# EAGLE design brains (EAGLE 7.3.0)
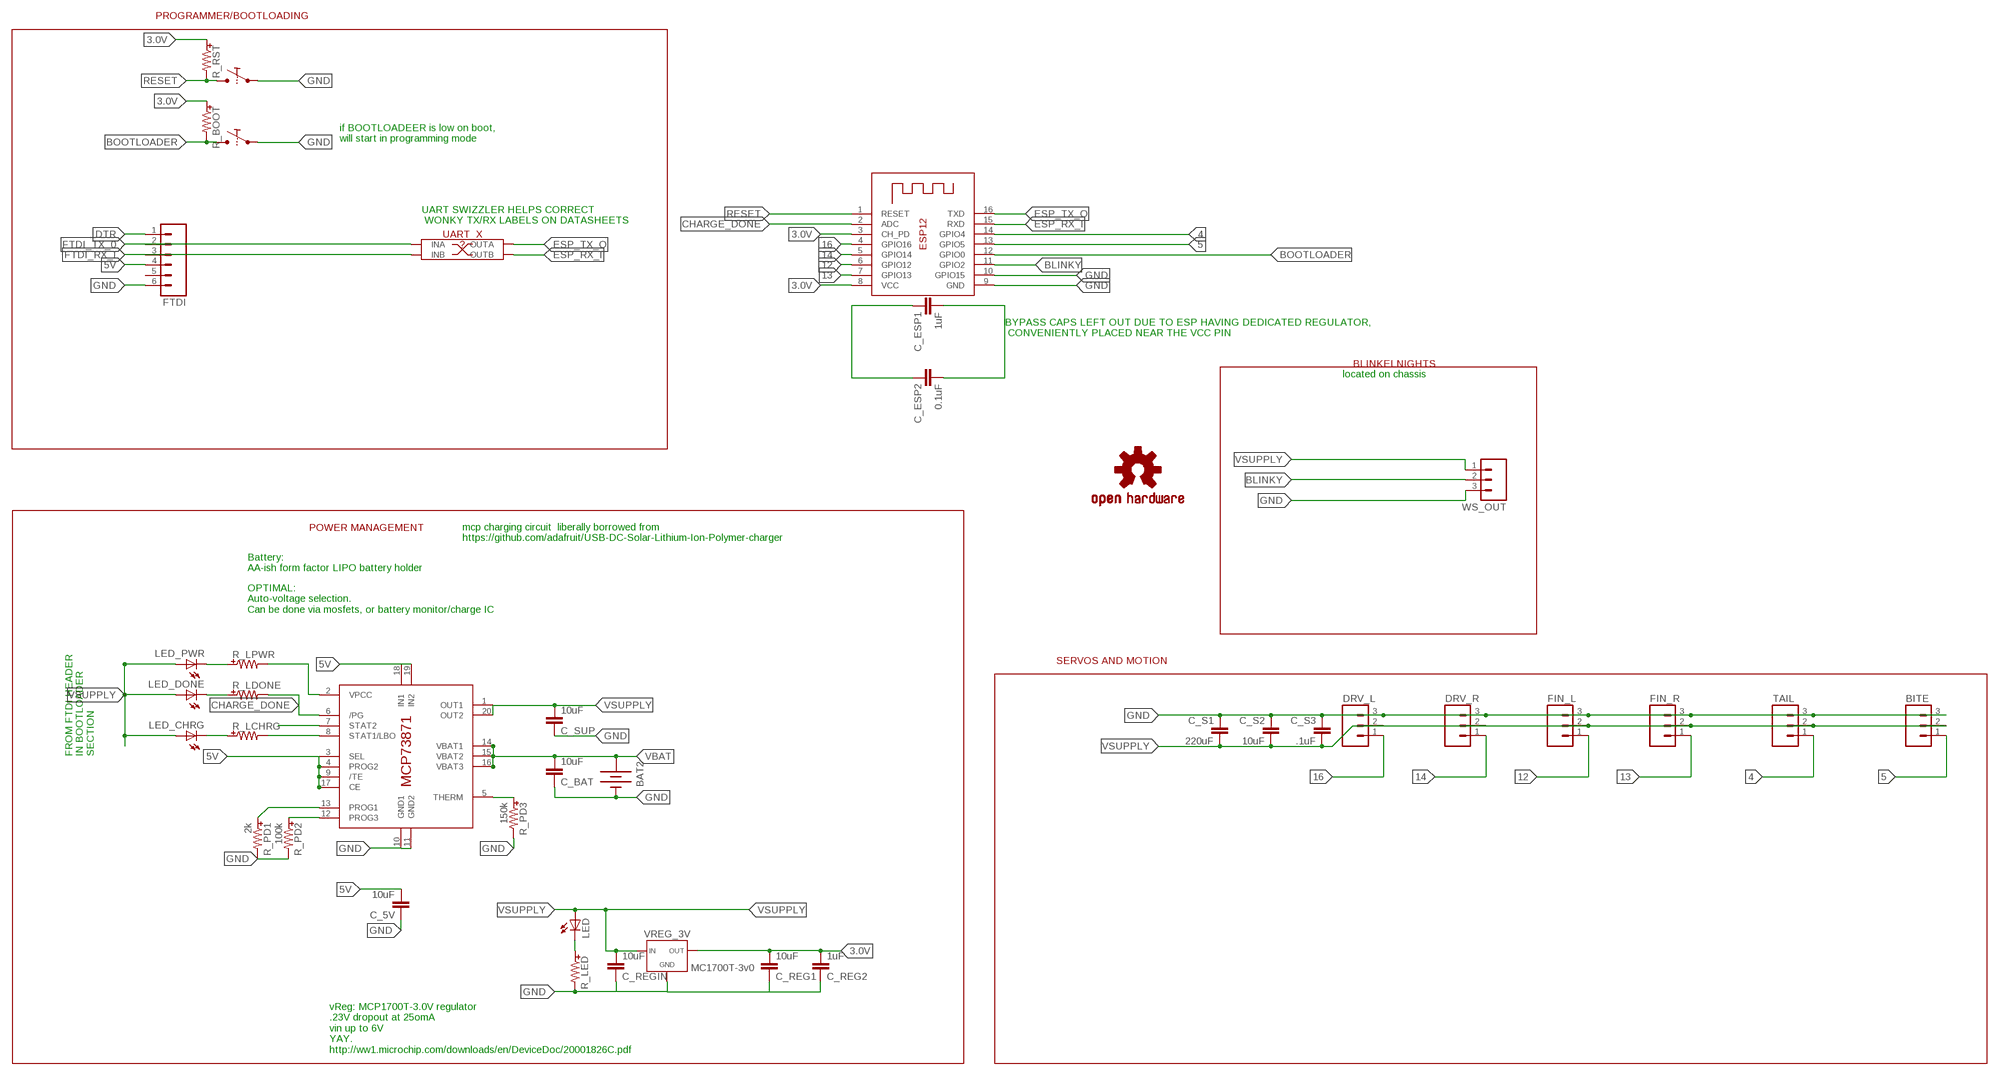
[diagram p0: schematic, sheet 1]

## Parts
BAT2  BATTERYAA  [BATTERY-AA]
BITE  M03LOCK  [1X03_LOCK]
BTN_PROG  BUTTONPJRC  [BUTTON-PJRC]
BTN_RST  BUTTONPJRC  [BUTTON-PJRC]
C_5V  10uF  CAPUNIVERSAL  [0402-0603-0805-UNIVERSAL]
C_BAT  10uF  CAPUNIVERSAL  [0402-0603-0805-UNIVERSAL]
C_ESP1  1uF  CAPUNIVERSAL  [0402-0603-0805-UNIVERSAL]
C_ESP2  0.1uF  CAPUNIVERSAL  [0402-0603-0805-UNIVERSAL]
C_REG1  10uF  CAPUNIVERSAL  [0402-0603-0805-UNIVERSAL]
C_REG2  1uF  CAPUNIVERSAL  [0402-0603-0805-UNIVERSAL]
C_REGIN  10uF  CAPUNIVERSAL  [0402-0603-0805-UNIVERSAL]
C_S1  220uF  CAP1210  [1210]
C_S2  10uF  CAPUNIVERSAL  [0402-0603-0805-UNIVERSAL]
C_S3  .1uF  CAPUNIVERSAL  [0402-0603-0805-UNIVERSAL]
C_SUP  10uF  CAPUNIVERSAL  [0402-0603-0805-UNIVERSAL]
DRV_L  M03LOCK  [1X03_LOCK]
DRV_R  M03LOCK  [1X03_LOCK]
FIN_L  M03LOCK  [1X03_LOCK]
FIN_R  M03LOCK  [1X03_LOCK]
FTDI  M06LOCK  [1X06_LOCK]
IC_LIPO  MCP73871  [QFN20]
LED  LEDUNIVERSAL  [0402-0603-0805-UNIVERSAL]
LED_CHRG  LEDUNIVERSAL  [0402-0603-0805-UNIVERSAL]
LED_DONE  LEDUNIVERSAL  [0402-0603-0805-UNIVERSAL]
LED_PWR  LEDUNIVERSAL  [0402-0603-0805-UNIVERSAL]
LOGO1  OSHW-LOGOS  [OSHW-LOGO-S]
R_BOOT  RESISTORUNIVERSAL  [0402-0603-0805-UNIVERSAL]
R_LCHRG  RESISTORUNIVERSAL  [0402-0603-0805-UNIVERSAL]
R_LDONE  RESISTORUNIVERSAL  [0402-0603-0805-UNIVERSAL]
R_LED  RESISTORUNIVERSAL  [0402-0603-0805-UNIVERSAL]
R_LPWR  RESISTORUNIVERSAL  [0402-0603-0805-UNIVERSAL]
R_PD1  2k  RESISTORUNIVERSAL  [0402-0603-0805-UNIVERSAL]
R_PD2  100k  RESISTORUNIVERSAL  [0402-0603-0805-UNIVERSAL]
R_PD3  150k  RESISTORUNIVERSAL  [0402-0603-0805-UNIVERSAL]
R_RST  RESISTORUNIVERSAL  [0402-0603-0805-UNIVERSAL]
TAIL  M03LOCK  [1X03_LOCK]
UART_X  UART_SWITCHER0603  [UART_SWITCHER_0603]
VREG_3V  MC1700T-3v0  VOLTAGE-REGULATORMCP1703  [SOT23]
WS_OUT  M03LOCK  [1X03_LOCK]
X1  ESP-12  [ESP-12]

## Nets
3.0V: C_REG1.+ C_REG2.+ R_BOOT.+ R_RST.+ VREG_3V.2(OUT) X1.3(CH_PD) X1.8(VCC)
4: TAIL.1 X1.14(GPIO4)
5: BITE.1 X1.13(GPIO5)
5V: C_5V.+ FTDI.4 IC_LIPO.3(SEL) IC_LIPO.4(PROG2) IC_LIPO.9(/TE) IC_LIPO.17(CE) IC_LIPO.18(IN1) IC_LIPO.19(IN2)
12: FIN_L.1 X1.6(GPIO12)
13: FIN_R.1 X1.7(GPIO13)
14: DRV_R.1 X1.5(GPIO14)
16: DRV_L.1 X1.4(GPIO16)
BLINKY: WS_OUT.2 X1.11(GPIO2)
BOOTLOADER: BTN_PROG.A1 BTN_PROG.A2 R_BOOT.- X1.12(GPIO0)
CHARGE_DONE: IC_LIPO.6(/PG) R_LDONE.- X1.2(ADC)
DTR: FTDI.1
ESP_RX_I: UART_X.TX_B(OUTB) X1.15(RXD)
ESP_TX_O: UART_X.RX_B(OUTA) X1.16(TXD)
FTDI_RX_I: FTDI.3 UART_X.RX_A(INB)
FTDI_TX_0: FTDI.2 UART_X.TX_A(INA)
GND: BAT2.GND@1(-) BITE.3 BTN_PROG.B1 BTN_PROG.B2 BTN_RST.B1 BTN_RST.B2 C_5V.- C_BAT.- C_REG1.- C_REG2.- C_REGIN.- C_S1.1 C_S2.- C_S3.- C_SUP.- DRV_L.3 DRV_R.3 FIN_L.3 FIN_R.3 FTDI.6 IC_LIPO.10(GND1) IC_LIPO.11(GND2) R_LED.- R_PD1.- R_PD2.- R_PD3.- TAIL.3 VREG_3V.1(GND) WS_OUT.3 X1.9(GND) X1.10(GPIO15)
N$1: IC_LIPO.8(STAT1/LBO) R_LCHRG.-
N$3: C_ESP1.- C_ESP2.-
N$4: IC_LIPO.5(THERM) R_PD3.+
N$5: LED_CHRG.-(C) R_LCHRG.+
N$6: LED.-(C) R_LED.+
N$7: LED_DONE.-(C) R_LDONE.+
N$8: LED_PWR.-(C) R_LPWR.+
N$9: IC_LIPO.2(VPCC) R_LPWR.-
N$10: C_ESP1.+ C_ESP2.+
N$20: IC_LIPO.7(STAT2)
N$22: IC_LIPO.12(PROG3) R_PD2.+
N$23: IC_LIPO.13(PROG1) R_PD1.+
RESET: BTN_RST.A1 BTN_RST.A2 R_RST.- X1.1(RESET)
VBAT: BAT2.PWR@1(+) C_BAT.+ IC_LIPO.14(VBAT1) IC_LIPO.15(VBAT2) IC_LIPO.16(VBAT3)
VSUPPLY: BITE.2 C_REGIN.+ C_S1.2 C_S2.+ C_S3.+ C_SUP.+ DRV_L.2 DRV_R.2 FIN_L.2 FIN_R.2 IC_LIPO.1(OUT1) IC_LIPO.20(OUT2) LED.+(A) LED_CHRG.+(A) LED_DONE.+(A) LED_PWR.+(A) TAIL.2 VREG_3V.3(IN) WS_OUT.1
Unconnected: FTDI.5

## Notes on the sheet
- PROGRAMMER/BOOTLOADING
- if BOOTLOADEER is low on boot, 
  will start in programming mode
- UART SWIZZLER HELPS CORRECT
   WONKY TX/RX LABELS ON DATASHEETS
- BYPASS CAPS LEFT OUT DUE TO ESP HAVING DEDICATED REGULATOR,
   CONVENIENTLY PLACED NEAR THE VCC PIN
- BLINKELNIGHTS
- located on chassis
- POWER MANAGEMENT
- mcp charging circuit  liberally borrowed from 
  https://github.com/adafruit/USB-DC-Solar-Lithium-Ion-Polymer-charger
- Battery: 
  AA-ish form factor LIPO battery holder
- OPTIMAL: 
  Auto-voltage selection. 
  Can be done via mosfets, or battery monitor/charge IC
- SERVOS AND MOTION
- FROM FTDI HEADER
  IN BOOTLOADER 
  SECTION
- vReg: MCP1700T-3.0V regulator
  .23V dropout at 25omA
  vin up to 6V 
  YAY.
  http://ww1.microchip.com/downloads/en/DeviceDoc/20001826C.pdf

## Library data of the parts
BAT2 = SparkFun-Electromechanical:BATTERY: Battery Holders Various common sizes : AA, AAA, 18650 (PRT-12895), 20mm coin cell and 12mm coin cell. 20MM_4LEGS, BATT-10373
BITE DRV_L DRV_R FIN_L FIN_R TAIL WS_OUT = SparkFun-Connectors:M03: Header 3 Standard 3-pin 0.1" header. Use with straight break away headers (SKU : PRT-00116), right angle break away headers (PRT-00553), swiss pins (PRT-00743), machine pins (PRT-00117), and female headers (PRT-00115). Molex polarized connector foot print use with SKU : PRT-08232 with associated crimp pins and housings.
BTN_PROG BTN_RST = tekdemo:BUTTON
C_5V C_BAT C_ESP1 C_ESP2 C_REG1 C_REG2 C_REGIN C_S1-C_S3 C_SUP = tekdemo:CAP: Capacitor Standard 0603 ceramic capacitor, and 0.1" leaded capacitor.
FTDI = SparkFun-Connectors:M06: Header 6 Standard 6-pin 0.1" header. Use with straight break away headers (SKU : PRT-00116), right angle break away headers (PRT-00553), swiss pins (PRT-00743), machine pins (PRT-00117), and female headers (PRT-00115). Molex polarized connector foot print use with SKU : PRT-08094 with associated crimp pins and housings. NOTES ON THE VARIANTS LOCK and LOCK_LONGPADS... This footprint was designed to help hold the alignment of a through-hole component (i.e. 6-pin header) while soldering it into place. You may notice that each hole has been shifted either up or down by 0.005 of an inch from it's more standard position (which is a perfectly straight line). This slight alteration caused the pins (the squares in the middle) to touch the edges of the holes. Because they are alternating, it causes a "brace" to hold the component in place. 0.005 has proven to be the perfect amount of "off-center" position when using our standard breakaway headers. Although looks a little odd when you look at the bare footprint, once you have a header in there, the alteration is very hard to notice. Also,if you push a header all the way into place, it is covered up entirely on the bottom side. This idea of altering the position of holes to aid alignment will be further integrated into the Sparkfun Library for other footprints. It can help hold any component with 3 or more connection pins.
IC_LIPO = adafruit:MCP73871
LED LED_CHRG LED_DONE LED_PWR = tekdemo:LED: LEDs Standard schematic elements and footprints for 5mm, 3mm, 1206, and 0603 sized LEDs. 5mm - Spark Fun Electronics SKU : Comp-SBL
LOGO1 = tekdemo:OSHW-LOGO: Open Source Hardware Logo This logo indicates the piece of hardware it is found on incorporates a OSHW license and/or adheres to the definition of open source hardware found here: http://freedomdefined.org/OSHW
R_BOOT R_LCHRG R_LDONE R_LED R_LPWR R_PD1-R_PD3 R_RST = tekdemo:RESISTOR: Resistor Basic schematic elements and footprints for 0603, 1206, and PTH resistors.
UART_X = tekdemo:UART_SWITCHER
VREG_3V = tekdemo:VOLTAGE-REGULATOR
X1 = adafruit:ESP-12

## Board
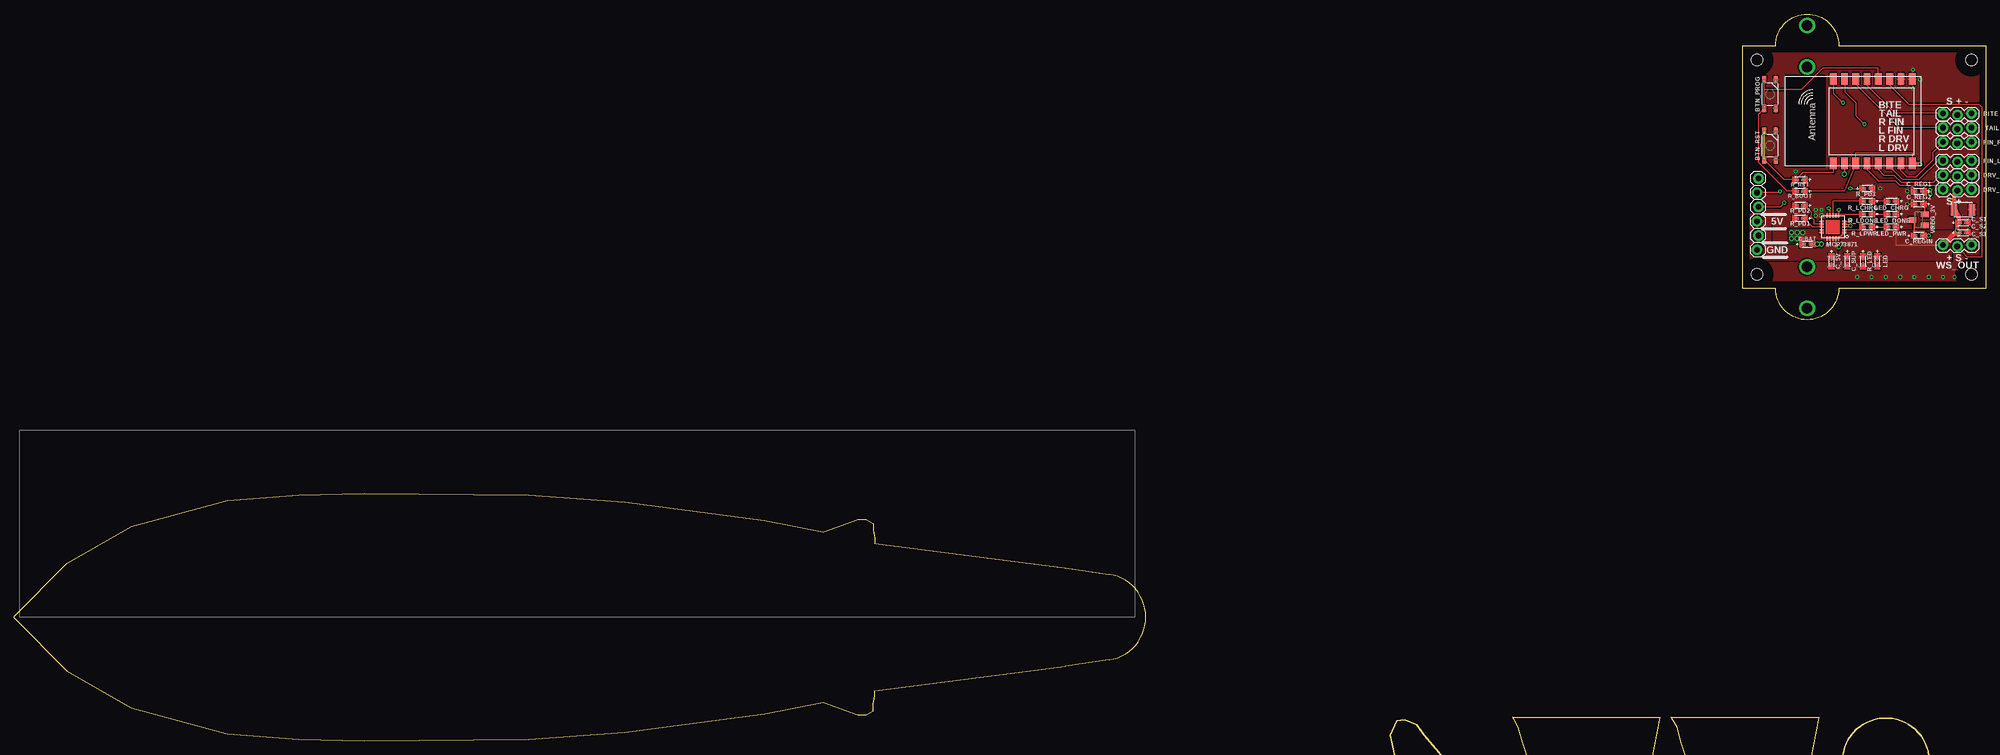
[diagram p1: board, top side]
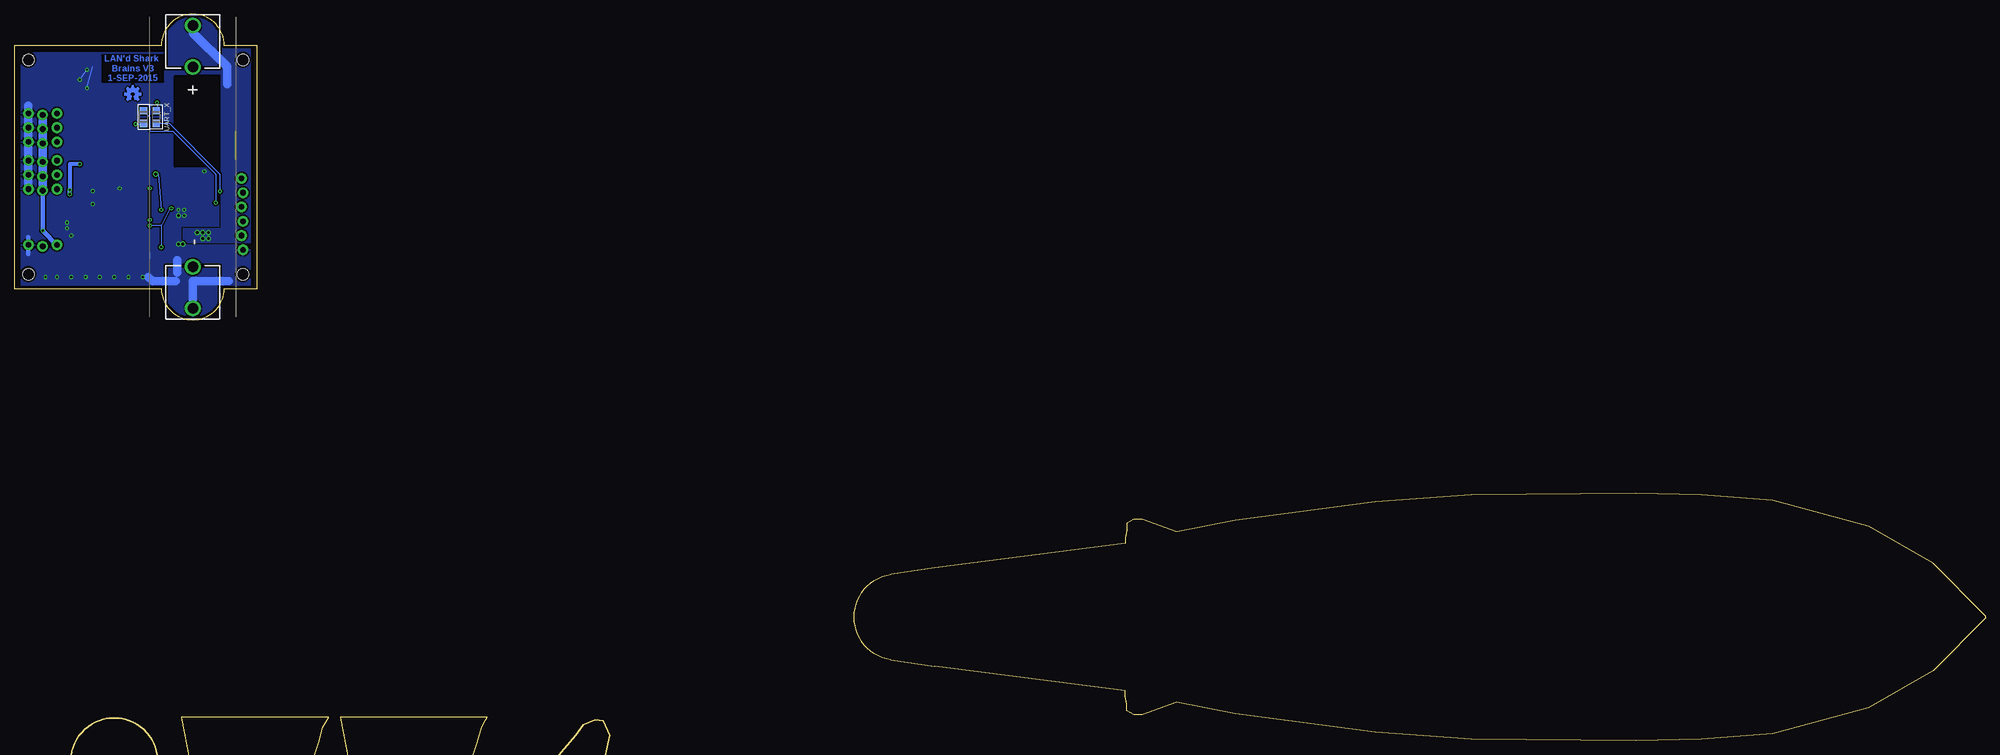
[diagram p2: board, bottom side, seen from below]

Size 350.27 x 129.16 mm. Coordinates in mm from the lower left corner, seen from the top.
Outline: 0,22.1 9.4,31.5 20.83,38.1 37.85,42.67 50.55,43.69 62.23,43.94 91.44,43.69 108.46,42.42 133.35,39.12 143.76,37.08 149.86,39.37 151.38,39.37 152.65,38.61 152.65,37.34 152.91,36.07 152.91,35.05 186.69,30.73 194.56,29.59 arc-161 194.56,14.35 186.69,13.21 152.91,8.89 152.91,7.87 152.65,6.6 152.65,5.33 151.38,4.57 149.86,4.57 143.76,6.86 133.35,4.83 108.46,1.52 91.44,0.25 62.23,0 50.55,0.25 37.85,1.27 20.83,5.84 9.4,12.45 0,21.84 0,22.1
Outline: 307.09,80.39 307.09,123.57 312.93,123.57 arc-90 318.52,129.16 arc-90 324.1,123.57 350.27,123.57 350.27,80.39 324.1,80.39 arc-90 318.52,74.8 arc-90 312.93,80.39 307.09,80.39
Copper layers (1*16): Top 0.0356mm / dielectric 1.5011mm / Bottom 0.0356mm
Design rules "LaenPCBOrder-tented": minimum track width 6mil, minimum drill 13mil, track to track 6mil, track to pad 6mil, pad to pad 6mil, via to via 6mil, smd to smd 0mil, copper to edge 15mil, drill to drill 6mil, minimum pad ring 7mil, minimum via ring 7mil, stop-mask expansion 4mil, vias tented up to drill 25mil, thermal gap 10mil
Holes 2.1 mm at 309.63,82.93 347.73,82.93 309.63,121.03 347.73,121.03
tRestrict: area 345.2,80.4 to 350.3,85.5; area 307.1,80.4 to 312.2,85.5; area 307.1,118.5 to 312.2,123.6; area 345.2,118.5 to 350.3,123.6
Milling: 178 lines

### Footprints (pad centres in the part's own frame; a part is rotated, then mirrored left to right if it is on the bottom)
BATTERY-AA = drill 1.854: GND@1 25.146,0; GND@2 17.78,0; PWR@1 -25.146,0; PWR@2 -17.78,0
1X03_LOCK = drill 1.016 pad 1.88: 1 0,0.127; 2 2.54,-0.127; 3 5.08,0.127
BUTTON-PJRC = smd 1.27 x 0.762: A1 -2.54,-1.016; A2 2.54,-1.016; B1 -2.54,1.016; B2 2.54,1.016
0402-0603-0805-UNIVERSAL = smd 0.254 x 0.254: + -0.762,0; - 0.762,0
1210 = smd 1.2 x 2: 1 -1.6,0; 2 1.6,0
1X06_LOCK = drill 1.016 pad 1.88: 1 0,0; 2 2.54,-0.254; 3 5.08,0; 4 7.62,-0.254; 5 10.16,0; 6 12.7,-0.254
QFN20 = smd 0.75 x 0.3: 1 -2,1; 2 -2,0.5; 3 -2,0; 4 -2,-0.5; 5 -2,-1; 11 2,-1; 12 2,-0.5; 13 2,0; 14 2,0.5; 15 2,1 | smd 0.3 x 0.75: 6 -1,-2; 7 -0.5,-2; 8 0,-2; 9 0.5,-2; 10 1,-2; 16 1,2; 17 0.5,2; 18 0,2; 19 -0.5,2; 20 -1,2
UART_SWITCHER_0603 = smd 1.27 x 1.27: RX_A -1.143,-1.143; RX_B -1.143,1.143; TX_A 1.143,1.143; TX_B 1.143,-1.143
SOT23 = smd 1 x 1.4: 1 -0.95,-1.1; 2 0.95,-1.1; 3 0,1.1
ESP-12 = smd 2 x 1.2: 1 -7.5,4.5; 2 -7.5,2.5; 3 -7.5,0.5; 4 -7.5,-1.5; 5 -7.5,-3.5; 6 -7.5,-5.5; 7 -7.5,-7.5; 8 -7.5,-9.5; 9 7.5,-9.5; 10 7.5,-7.5; 11 7.5,-5.5; 12 7.5,-3.5; 13 7.5,-1.5; 14 7.5,0.5; 15 7.5,2.5; 16 7.5,4.5

### Placement (x,y rotation side)
BAT2  318.52,101.98 270 bottom
BITE  342.65,111.38 0 top
BTN_PROG  311.91,114.94 270 top
BTN_RST  311.91,105.79 270 top
C_5V  322.83,85.22 270 top
C_BAT  318.52,88.27 0 top
C_ESP1  355.09,122.05 0 top  (outside the outline)
C_ESP2  355.09,124.33 0 top  (outside the outline)
C_REG1  338.33,97.66 180 top
C_REG2  338.33,95.38 180 top
C_REGIN  338.33,89.79 0 top
C_S1  346.2,94.36 180 top
C_S2  346.2,92.08 0 top
C_S3  346.2,90.3 0 top
C_SUP  325.63,85.22 270 top
DRV_L  342.65,97.92 0 top
DRV_R  342.65,100.46 0 top
FIN_L  342.65,103 0 top
FIN_R  342.65,106.3 0 top
FTDI  309.88,99.95 270 top
IC_LIPO  323.09,91.31 180 top
LED  330.96,85.22 270 top
LED_CHRG  333.5,95.89 180 top
LED_DONE  333.5,93.6 180 top
LED_PWR  333.5,91.31 180 top
LOGO1  329.18,114.94 0 bottom
R_BOOT  317.25,97.66 180 top
R_LCHRG  329.18,95.89 180 top
R_LDONE  329.18,93.6 180 top
R_LED  328.42,85.22 270 top
R_LPWR  329.18,91.31 180 top
R_PD1  317.25,92.84 180 top
R_PD2  317.25,95.12 180 top
R_PD3  329.18,98.17 0 top
R_RST  317.25,99.7 180 top
TAIL  342.65,108.84 0 top
UART_X  326.14,110.87 270 bottom
VREG_3V  338.33,92.58 90 top
WS_OUT  342.65,88.01 0 top
X1  327.66,110.11 90 top

### Tracks (layer width: path | path; a pad name or v marks a point on that pad's centre or on a via)
3.0V  (via drill 0.33)
  Top 0.203: R_RST.+ R_BOOT.+ 325.13,97.66 X1.3 327.16,104.52 337.16,104.52 X1.8
  Top 0.305: VREG_3V.2 339.43,95.04 C_REG2.+ C_REG1.+ 339.34,97.66 | 339.34,97.66 v340.36,97.16 | v340.36,97.92 339.34,97.66
  Top 0.711: v340.36,97.16 v340.36,97.92 | v338.58,102.49 337.28,102.49 X1.8
  Bottom 0.711: v338.58,102.49 340.36,102.49 v340.36,97.92 v340.36,97.16
4
  Top 0.203: TAIL.1 334.9,108.97 327.41,116.46 327.41,117.36 X1.14
5
  Top 0.203: BITE.1 334.14,111.51 329.18,116.46 329.18,117.59 X1.13
5V  (via drill 0.33)
  Top 0.203: IC_LIPO.9 322.59,94.61 v322.33,94.62 | IC_LIPO.3 326.14,91.31 v326.14,91.57 326.14,91.81 IC_LIPO.4 | v324.1,87.76 323.59,87.76 IC_LIPO.19 | IC_LIPO.17 322.58,88.01
  Bottom 0.203: v322.33,94.62 322.58,94.62 324.1,91.57 | 324.1,91.57 v326.14,91.57 | 324.1,91.57 v324.1,87.76
  pour Top (isolate 0.254, rank 3): 323.85,90.04 321.82,90.04 321.82,88.01 312.17,88.01 312.17,93.6 308.36,93.6 308.36,85.47 323.85,85.47
12
  Top 0.203: FIN_L.1 341.76,103.12 338.33,99.7 335.53,99.7 333.76,101.47 X1.6
13
  Top 0.203: FIN_R.1 340.87,104.65 340.87,103.25 337.82,100.2 336.3,100.2 335.16,101.34 X1.7
14
  Top 0.203: DRV_R.1 342.26,100.58 340.87,99.19 335.28,99.19 334.01,100.46 332.23,100.46 331.22,101.47 331.22,102.55 X1.5
16
  Top 0.203: X1.4 329.18,102.59 329.18,101.47 331.22,99.44 334.26,99.44 335.03,98.68 342.01,98.68 DRV_L.1
BLINKY
  Top 0.203: X1.11 333.16,116.55 336.55,113.16 349,113.16 349.5,112.65 349.5,85.98 346.96,85.98 WS_OUT.2
BOOTLOADER
  Top 0.203: 310.9,115.7 BTN_PROG.A2 309.88,111.38 309.88,102.74 314.96,97.66 R_BOOT.- | 310.9,115.7 BTN_PROG.A1 | X1.12 331.16,119.51 321.31,119.51 317.5,115.7 310.9,115.7
CHARGE_DONE  (via drill 0.33, 0.51)
  Top 0.203: R_LDONE.- 324.09,93.6 IC_LIPO.6 324.09,94.36 v324.1,94.36 | X1.2 325.12,102.61 v325.12,100.71
  Bottom 0.203: v325.12,100.71 324.61,100.71 v324.1,94.36
ESP_RX_I  (via drill 0.3)
  Top 0.203: X1.15 325.16,115.4 327.15,113.41 327.15,111.12 v328.68,109.6
  Bottom 0.203: v328.68,109.6 327.41,109.6 UART_X.TX_B
ESP_TX_O  (via drill 0.3)
  Top 0.203: X1.16 323.16,115.12 v324.87,113.41
  Bottom 0.203: v324.87,113.41 324.87,112.14 UART_X.RX_B
FTDI_RX_I  (via drill 0.3)
  Top 0.203: v314.45,95.63 313.69,94.87 FTDI.3
  Bottom 0.203: UART_X.RX_A 326.14,110.87 326.14,108.33 322.07,108.33 314.45,100.71 v314.45,95.63
FTDI_TX_0  (via drill 0.3)
  Top 0.203: v313.69,97.66 313.44,97.41 FTDI.2
  Bottom 0.203: UART_X.TX_A 322.71,109.73 313.69,100.71 v313.69,97.66
GND  (via drill 0.3, 0.33, 0.51)
  Top 0.203: X1.9 337.06,117.61
  Top 0.305: C_REG2.- v336.3,95.38 | C_REGIN.- v340.11,89.79
  Top 0.508: v320.29,88.27 C_BAT.- v321.06,88.27
  Bottom 0.203: 326.14,86.74 326.14,85.73 | v338.58,117.48 v337.31,119.25 | v337.31,115.95 336.3,119.76
  Bottom 0.762: 347.73,86.49 WS_OUT.3 347.73,89.54
  Bottom 1.524: 347.73,97.92 347.73,112.9 | 326.39,82.42 325.63,81.66 321.56,81.66 | BAT2.GND@1 318.52,81.66 312.17,81.66 | 321.31,83.19 321.31,85.47
  other vias: 321.06,93.34 327.41,82.42 329.95,82.42 332.49,82.42 335.03,82.42 337.57,82.42 340.11,82.42 342.65,82.42 344.68,82.42 320.04,94.36 321.06,94.36 320.04,93.34 331.47,98.17 336.3,97.66 340.87,92.08 340.87,91.06 316.48,101.22
  pour Top (isolate 0.254, rank 6): 308.36,81.66 308.36,122.3 349,122.3 349,81.66
  pour Bottom (isolate 0.254, rank 6): 308.36,75.31 308.36,122.3 349,122.3 349,75.31
N$1
  Top 0.203: R_LCHRG.- 323.09,95.89 IC_LIPO.8
N$3  (1 unrouted)
N$4  (via drill 0.33)
  Top 0.203: IC_LIPO.5 326.14,92.31 v326.14,92.58 | v326.14,98.17 R_PD3.+
  Bottom 0.203: v326.14,92.58 v326.14,98.17
N$5
  Top 0.203: LED_CHRG.- R_LCHRG.+
N$6
  Top 0.203: LED.- R_LED.+
N$7
  Top 0.203: R_LDONE.+ LED_DONE.-
N$8
  Top 0.203: R_LPWR.+ LED_PWR.-
N$9
  Top 0.203: IC_LIPO.2 327.92,90.81 R_LPWR.-
N$10  (1 unrouted)
N$22
  Top 0.203: IC_LIPO.12 319.79,91.81 319.79,92.58 319.28,93.09 319.29,93.84 R_PD2.+
N$23
  Top 0.203: IC_LIPO.13 319.53,91.31 R_PD1.+
RESET  (1 unrouted)
  Top 0.203: X1.1 323.16,100.97 317.75,100.97 R_RST.- 314.45,99.7 BTN_RST.A2
VBAT  (via drill 0.51)
  Top 0.508: C_BAT.+ 317.75,89.28 v316.74,89.28
  Bottom 0.203: BAT2.PWR@1 318.52,125.86
  Bottom 1.524: 318.52,125.86 312.42,119.76 312.42,116.71
  other vias: 316.74,90.3 315.72,90.3 317.75,90.3 315.72,89.28
  pour Bottom (isolate 0.254): 323.34,129.41 308.36,129.41 308.36,88.52 313.44,88.52 313.44,118.49 323.34,118.49
  pour Top (isolate 0.254): 322.33,88.77 322.33,90.81 315.21,90.81 315.21,88.77
  pour Bottom (isolate 0.254): 308.36,88.52 308.36,91.06 320.29,91.06 320.29,88.52
VSUPPLY  (via drill 0.33)
  Top 0.203: LED_CHRG.+ LED_DONE.+ LED_PWR.+ 334.26,88.14 WS_OUT.1
  Top 0.305: IC_LIPO.20 IC_LIPO.1 | C_REGIN.+ 337.57,92.25 VREG_3V.3
  Top 0.762: C_S3.+ 344.81,90.3 WS_OUT.1 | v345.19,90.68 345.19,91.82 C_S2.+ 345.44,93.09 344.68,94.62 | C_S1.2 344.6,97.21 DRV_L.2
  Bottom 0.762: DRV_L.2 v345.19,90.68 WS_OUT.1
  Bottom 1.524: BITE.2 TAIL.2 FIN_R.2 FIN_L.2 DRV_R.2 DRV_L.2
  pour Top (isolate 0.254, rank 5): 323.85,90.55 323.85,85.47 344.17,85.47 344.17,90.55

### Text on the board
Bottom: LAN'd Shark / Brains V3 / 1-SEP-2015
tPlace: S + - | BITE / TAIL / R FIN / L FIN / R DRV / L DRV | S + - | 5V | GND | + S -
bStop: LAN'd Shark / Brains V3 / 1-SEP-2015